# Altium schematic sheet Stepper Motor Driver.SchDoc: Stepper Motor Driver
size Tabloid; DocumentNumber: LM-004; Revision: C; SheetNumber: 3; SheetTotal: 3
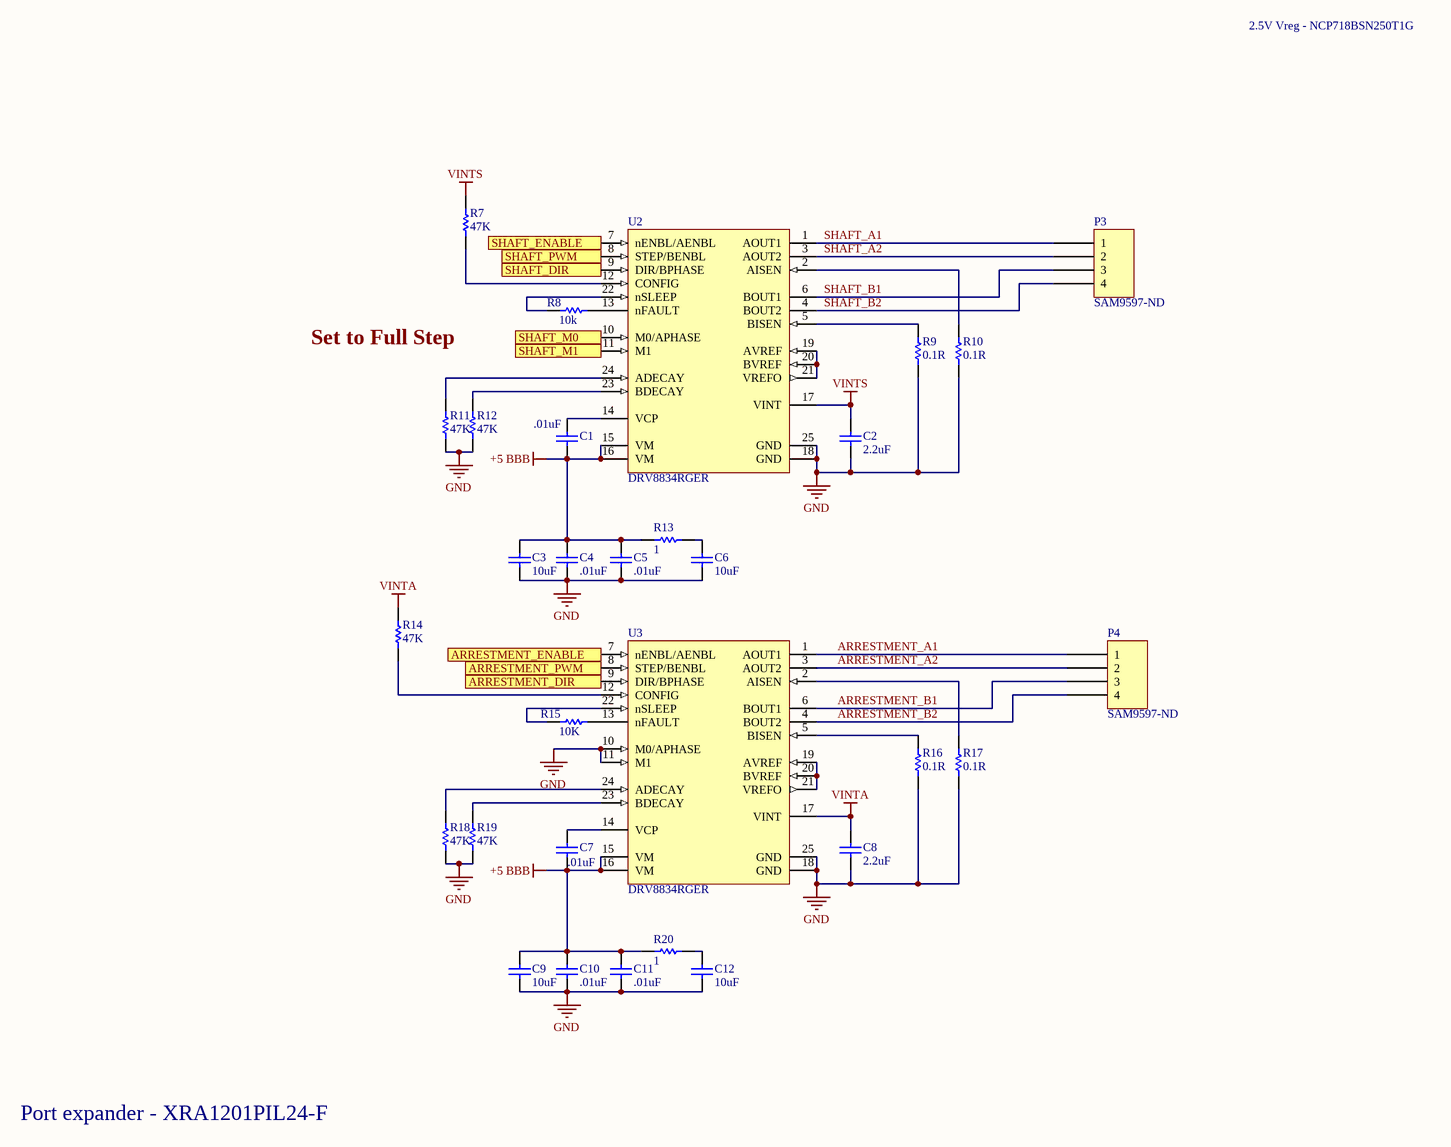
[diagram p0: Stepper Motor Driver.SchDoc]

## Parts
C1  .01uF  [CAPC0402(1005)60_N]
C2  2.2uF  [CAPC0402(1005)60_N]
C3  10uF  [CAPC0402(1005)60_N]
C4  .01uF  [CAPC0402(1005)60_N]
C5  .01uF  [CAPC0402(1005)60_N]
C6  10uF  [CAPC0402(1005)60_N]
C7  .01uF  [CAPC0402(1005)60_N]
C8  2.2uF  [CAPC0402(1005)60_N]
C9  10uF  [CAPC0402(1005)60_N]
C10  .01uF  [CAPC0402(1005)60_N]
C11  .01uF  [CAPC0402(1005)60_N]
C12  10uF  [CAPC0402(1005)60_N]
P3  Supplier Part Number 1: SAM9597-ND  [IPL1-104-01-L-S-RA-K]  (hidden comment: IPL1-104-01-L-S-RA-K)
P4  Supplier Part Number 1: SAM9597-ND  [IPL1-104-01-L-S-RA-K]  (hidden comment: IPL1-104-01-L-S-RA-K)
R7  47K  [RESC0402(1005)_M]
R8  10k  [RESC0402(1005)_M]
R9  0.1R  [RESC0402(1005)_M]
R10  0.1R  [RESC0402(1005)_M]
R11  47K  [RESC0402(1005)_M]
R12  47K  [RESC0402(1005)_M]
R13  1  [RESC0402(1005)_M]
R14  47K  [RESC0402(1005)_M]
R15  10K  [RESC0402(1005)_M]
R16  0.1R  [RESC0402(1005)_M]
R17  0.1R  [RESC0402(1005)_M]
R18  47K  [RESC0402(1005)_M]
R19  47K  [RESC0402(1005)_M]
R20  1  [RESC0402(1005)_M]
U2  DRV8834RGER  [RGE0024B_V]
U3  DRV8834RGER  [RGE0024B_V]

## Ports
ARRESTMENT_DIR, ARRESTMENT_ENABLE, ARRESTMENT_PWM, SHAFT_DIR, SHAFT_ENABLE, SHAFT_M0, SHAFT_M1, SHAFT_PWM

## Nets
+5 BBB: C1.1 C3.2 C4.2 C5.2 C7.1 C9.2 C10.2 C11.2 R13.1 R20.1 U2.15(VM) U2.16(VM) U3.15(VM) U3.16(VM)
GND: C2.1 C3.1 C4.1 C5.1 C6.1 C8.1 C9.1 C10.1 C11.1 C12.1 R9.2 R10.2 R11.2 R12.2 R16.2 R17.2 R18.2 R19.2 U2.18(GND) U2.25(GND) U3.10(M0/APHASE) U3.11(M1) U3.18(GND) U3.25(GND)
VINTA: C8.2 R14.1 U3.17(VINT)
VINTS: C2.2 R7.1 U2.17(VINT)
ARRESTMENT_A1: P4.1 U3.1(AOUT1)
ARRESTMENT_A2: P4.2 U3.3(AOUT2)
ARRESTMENT_B1: P4.3 U3.6(BOUT1)
ARRESTMENT_B2: P4.4 U3.4(BOUT2)
ARRESTMENT_DIR: U3.9(DIR/BPHASE) ; port ARRESTMENT_DIR
ARRESTMENT_ENABLE: U3.7(nENBL/AENBL) ; port ARRESTMENT_ENABLE
ARRESTMENT_PWM: U3.8(STEP/BENBL) ; port ARRESTMENT_PWM
SHAFT_A1: P3.1 U2.1(AOUT1)
SHAFT_A2: P3.2 U2.3(AOUT2)
SHAFT_B1: P3.3 U2.6(BOUT1)
SHAFT_B2: P3.4 U2.4(BOUT2)
SHAFT_DIR: U2.9(DIR/BPHASE) ; port SHAFT_DIR
SHAFT_ENABLE: U2.7(nENBL/AENBL) ; port SHAFT_ENABLE
SHAFT_M0: U2.10(M0/APHASE) ; port SHAFT_M0
SHAFT_M1: U2.11(M1) ; port SHAFT_M1
SHAFT_PWM: U2.8(STEP/BENBL) ; port SHAFT_PWM
NetC1_2: C1.2 U2.14(VCP)
NetC6_2: C6.2 R13.2
NetC7_2: C7.2 U3.14(VCP)
NetC12_2: C12.2 R20.2
NetR7_2: R7.2 U2.12(CONFIG)
NetR8_1: R8.1 U2.22(nSLEEP)
NetR8_2: R8.2 U2.13(nFAULT)
NetR9_1: R9.1 U2.5(BISEN)
NetR10_1: R10.1 U2.2(AISEN)
NetR11_1: R11.1 U2.24(ADECAY)
NetR12_1: R12.1 U2.23(BDECAY)
NetR14_2: R14.2 U3.12(CONFIG)
NetR15_1: R15.1 U3.22(nSLEEP)
NetR15_2: R15.2 U3.13(nFAULT)
NetR16_1: R16.1 U3.5(BISEN)
NetR17_1: R17.1 U3.2(AISEN)
NetR18_1: R18.1 U3.24(ADECAY)
NetR19_1: R19.1 U3.23(BDECAY)
NetU2_19: U2.19(AVREF) U2.20(BVREF) U2.21(VREFO)
NetU3_19: U3.19(AVREF) U3.20(BVREF) U3.21(VREFO)

## Notes on the sheet
- 2.5V Vreg - NCP718BSN250T1G
- Set to Full Step
- Port expander - XRA1201PIL24-F
- Title
- Size:
- Date:
- Tabloid
- Number:
- Time:
- Revision:
- Sheet
- of
- ZLS Corporation
- 7801 North Lamar Blvd.
- Suite E-184
- Austin, Texas 78752  USA
- (512) 453-0288
- File:

## Library data of the parts
C1-C12 = CMP-1034-01365-1: CAP 220pF 25V ±10% 0402 (1005 Metric) Thickness 0.6mm SMD
R7-R20 = CMP-1011-00463-1
U2 U3 = CMP-1685-00004-1: Dual-Bridge Stepper or DC Motor Driver, 2.5 to 10.8 V, -40 to 85 degC, 24-pin QFN (RGE), Green (RoHS & no Sb/Br), Tape and Reel; Min Supply Voltage: 2.5 V; Output Current: 1.5 A; Nominal Supply Current: 4 mA; Max Operating Temperature: 85 degC; Pins: 24; Packaging: Tape and Reel; ComponentLink2Description: Datasheet; ComponentLink2URL: http://www.ti.com/general/docs/lit/getliterature.tsp?genericPartNumber=DRV8834&fileType=pdf; Mounting Technology: Surface Mount; ComponentLink1URL: http://www.ti.com/; Package Quantity: 3000; Mount: Surface Mount; Min Operating Temperature: -40 degC; RoHSCompliant: true; Radiation Hardening: No; PackageDescription: 24-Pin Quad Flat No-lead Package, Body 4 x 4 mm, Pitch 0.5 mm; DatasheetVersion: SLVSB19D, 03/2015; PackageReference: RGE0024B; ComponentLink1Description: Manufacturer URL
P3 P4 = IPL1-104-01-L-S-RA-K: Supplier 1: Digi-Key